# Altium schematic sheet LEDcircuits_PhaseV.SchDoc
size A4; SheetNumber: 5; SheetTotal: 6
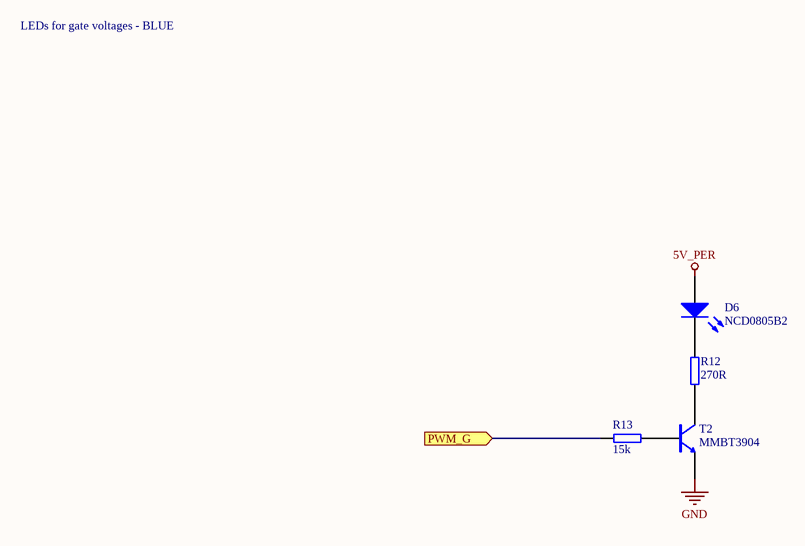
[diagram p0: LEDcircuits_PhaseV.SchDoc]

## Parts
D6  NCD0805B2  [LEDM2012X80N]
R12  270R  [RES 0603_1608]
R13  15k  [RES 0603_1608]
T2  MMBT3904  [SOT95P280X145-3N]

## Ports
PWM_G (in)

## Nets
5V_PER: D6.2(A)
GND: T2.2(EMITTER)
PWM_G: R13.1 ; port PWM_G
NetD6_1: D6.1(K) R12.2
NetR12_1: R12.1 T2.3(COLLECTOR)
NetR13_2: R13.2 T2.1(BASIS)

## Notes on the sheet
- LEDs for gate voltages - BLUE
- Title
- Revision:
- Design Engineer:
- Date:
- Project:
- Sheet
- of

## Library data of the parts
D6 = NCD0805B2: Blue 0805 Light Emitting Diodes (LED) ROHS; Manufacturer: Foshan NationStar Optoelectronics; Type: Standard; Created from: NDiringer; Forward Current I_f: 20 mA; Forward Voltage U_f: 2.7 V; Wavelength: 472 nm; Light Intensity: 36 mcd; Nominal Power: 72 mW; Manufacturer Part Number: NCD0805B2; PartID: 15; Created On: 06.05.2022 14:16:21; ComponentLink1Description: Datasheet; ComponentLink1URL: https://datasheet.lcsc.com/lcsc/2008201032_Foshan-NationStar-Optoelectronics-NCD0805B2_C84259.pdf; Component Type: LED Diode; Device Package: 0805; Last Updated: 06.05.2022 14:17:19; Mounting Type: SMD; Operating Temperature: -40 - 85 °C; Supplier 1: LCSC; Supplier Part Number 1: C84259; Live Cycle Status: 1; Stock number: not stored; Color: blue; LCSC Part Number: C84259
R12 = 0603WAF2700T5E: 1/10W Thick Film Resistors 75V ±1% ±100ppm/℃ -55℃~+155℃ 270Ω 0603 Chip Resistor - Surface Mount ROHS; Manufacturer: UNI-ROYAL(Uniroyal Elec); Created from: NDiringer; Manufacturer Part Number: 0603WAF2700T5E; PartID: 228; Created On: 10.08.2022 13:23:32; ComponentLink1Description: Datasheet; ComponentLink1URL: https://datasheet.lcsc.com/lcsc/2206010130_UNI-ROYAL-Uniroyal-Elec-0603WAF2700T5E_C22966.pdf; Component Type: SMD resistor; Device Package: 0603; Last Updated: 10.08.2022 13:40:57; Mounting Type: SMD; Supplier 1: LCSC/JLCPCB; Supplier Part Number 1: C22966; Supplier 2: Mouser; Supplier Part Number 2: 303-0603WAF2700T5E; Type: Resistor; Tolerance: 1%; Value: 270R; Live Cycle Status: 1; Stock number: not stored; LCSC Part Number: C22966
R13 = RK73B1JTTD153J: SMD resistor E24 series; Manufacturer: KOA Speer; Tolerance: 5%; Created from: MGremer; Manufacturer Part Number: RK73B1JTTD153J; PartID: 102; Created On: 14.12.2020 16:17:14; ComponentLink1Description: Datasheet; ComponentLink1URL: https://www.mouser.de/datasheet/2/219/RK73B-1825463.pdf; Component Type: SMD resistor; Device Package: 0603; Last Updated: 27.05.2022 13:41:55; Mounting Type: SMD; Supplier 1: Mouser; Supplier Part Number 1: 660-RK73B1JTTD153J; Type: Resistor; Value: 15k; Live Cycle Status: 1; Stock number: Labor SMD Container; LCSC Part Number: C22809
T2 = MMBT3904: Bipolartransistor, 40V 200mW 200mA 100@10mA,1V 300MHz 300mV@50mA,5mA NPN +150℃@(Tj) SOT-23(SOT-23-3); Manufacturer: Jiangsu Changjing Electronics Technology Co., Ltd.; Number Of Channels: single; Collector Basis Voltage: 60 V; Created from: NDiringer; Manufacturer Part Number: MMBT3904; PartID: 2; Created On: 10.06.2022 12:04:49; ComponentLink1Description: Datasheet; ComponentLink1URL: https://datasheet.lcsc.com/lcsc/1811011934_Jiangsu-Changjing-Electronics-Technology-Co---Ltd--MMBT3904_C20526.pdf; Component Type: Bipolartransistor; Device Package: SOT-23-3; Last Updated: 10.08.2022 13:48:16; Mounting Type: SMD; Operating Temperature: -55 - 150 °C; Series: MMBT3904; Supplier 1: Mouser; Supplier Part Number 1: MMBT3904; Type: Bipolartransistor; Collector Emitter Voltage: 40 V; Polarization: NPN; Power Dissipation: 200 mW; Value: 40 V; Live Cycle Status: 1; Supplier 2: LCSC/JLCPCB; Supplier Part Number 2: C20526; LCSC Part Number: C20526